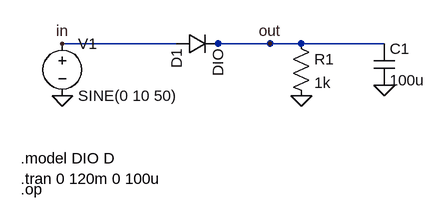
[diagram p0: schematic diode_half_wave_rectifier.asc]
diode_half_wave_rectifier.asc, the LTspice schematic file:
Version 4
SHEET 1 1400 950
WIRE 112 176 288 176
WIRE 352 176 480 176
WIRE 352 176 608 176
WIRE 352 176 432 176
FLAG 112 176 in
FLAG 432 176 out
FLAG 112 256 0
FLAG 480 256 0
FLAG 608 240 0
SYMBOL voltage 112 160 R0
SYMATTR InstName V1
SYMATTR Value SINE(0 10 50)
SYMBOL diode 288 160 M90
SYMATTR InstName D1
SYMATTR Value DIO
SYMBOL res 464 160 R0
SYMATTR InstName R1
SYMATTR Value 1k
SYMBOL cap 592 176 R0
SYMATTR InstName C1
SYMATTR Value 100u
TEXT 48 352 Left 2 !.model DIO D
TEXT 48 384 Left 2 !.tran 0 120m 0 100u
TEXT 48 400 Left 2 !.op

The netlist it stands for:
* diode_half_wave_rectifier.asc
V1 in 0 SINE(0 10 50)
D1 in out DIO
R1 out 0 1k
C1 out 0 100u
.model D D
.lib standard.dio
.model DIO D
.tran 0 120m 0 100u
.op
.backanno
.end